# EAGLE schematic Enclosure_Control (EAGLE 9.5.0)
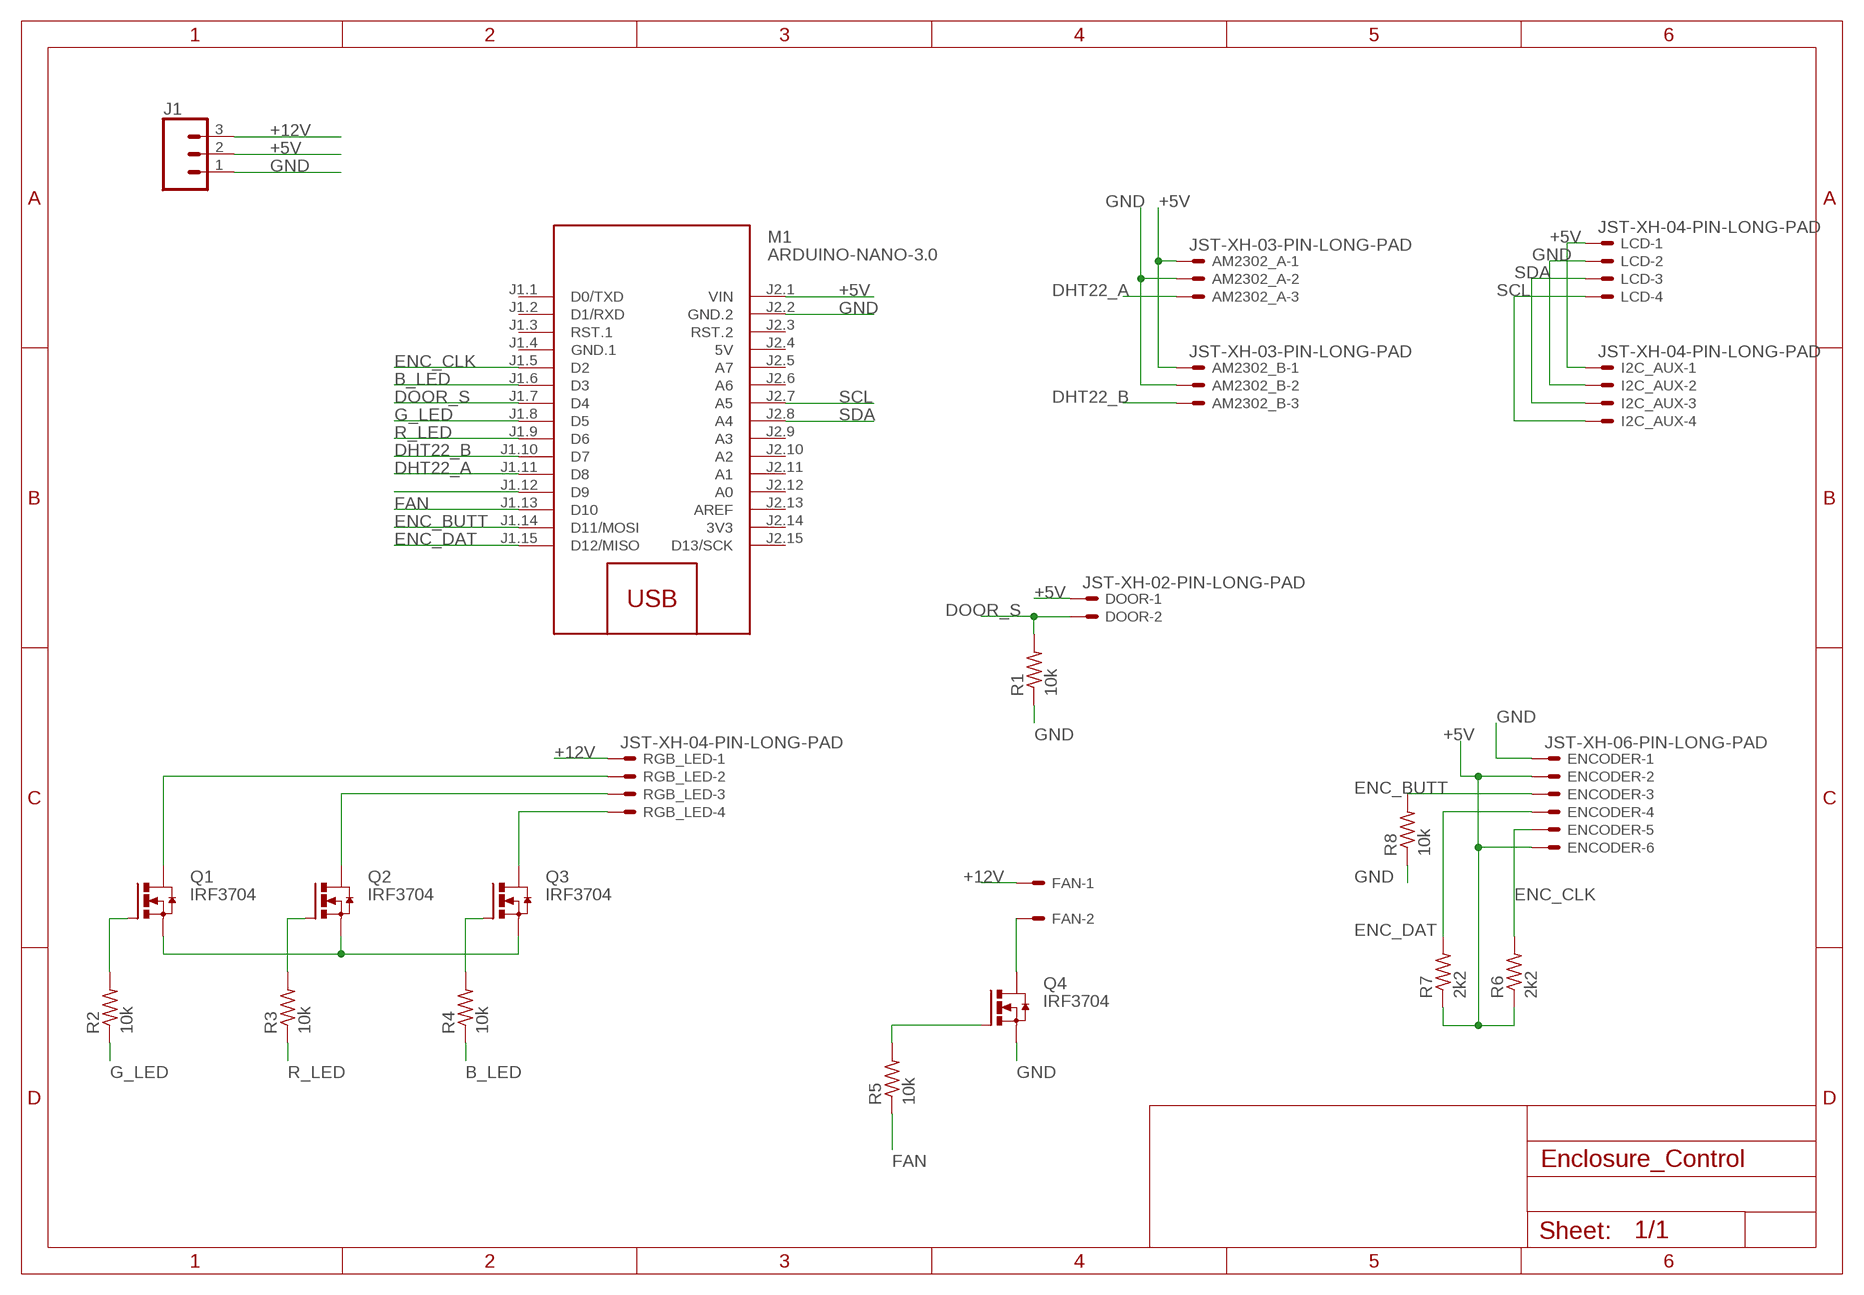
[diagram p0: schematic, sheet 1]

## Parts
AM2302_A  JST-XH-03-PIN-LONG-PAD  [JST-XH-03-PACKAGE-LONG-PAD]
AM2302_B  JST-XH-03-PIN-LONG-PAD  [JST-XH-03-PACKAGE-LONG-PAD]
DOOR  JST-XH-02-PIN-LONG-PAD  [JST-XH-02-PACKAGE-LONG-PAD]
ENCODER  JST-XH-06-PIN-LONG-PAD  [JST-XH-06-PACKAGE-LONG-PAD]
FAN  KK-156-2  [KK-156-2]
I2C_AUX  JST-XH-04-PIN-LONG-PAD  [JST-XH-04-PACKAGE-LONG-PAD]
J1  CONN_03SCREW-NS  [SCREWTERMINAL-3.5MM-3-NS]
LCD  JST-XH-04-PIN-LONG-PAD  [JST-XH-04-PACKAGE-LONG-PAD]
M1  ARDUINO-NANO-3.0  [ARDUINO-NANO-3.0]
Q1  IRF3704  [TO220AH]
Q2  IRF3704  [TO220AH]
Q3  IRF3704  [TO220AH]
Q4  IRF3704  [TO220AH]
R1  10k  R-US_0309/12  [0309/12]
R2  10k  R-US_0309/12  [0309/12]
R3  10k  R-US_0309/12  [0309/12]
R4  10k  R-US_0309/12  [0309/12]
R5  10k  R-US_0309/12  [0309/12]
R6  2k2  R-US_0309/12  [0309/12]
R7  2k2  R-US_0309/12  [0309/12]
R8  10k  R-US_0309/12  [0309/12]
RGB_LED  JST-XH-04-PIN-LONG-PAD  [JST-XH-04-PACKAGE-LONG-PAD]

## Nets
+5V: AM2302_A.1 AM2302_B.1 DOOR.1 ENCODER.2 ENCODER.6 I2C_AUX.1 J1.2 LCD.1 M1.J2.1(VIN) R6.1 R7.1
+12V: FAN.1 J1.3 RGB_LED.1
B_LED: M1.J1.6(D3) R4.1
DHT22_A: AM2302_A.3 M1.J1.11(D8)
DHT22_B: AM2302_B.3 M1.J1.10(D7)
DOOR_S: DOOR.2 M1.J1.7(D4) R1.2
ENC_BUTT: ENCODER.3 M1.J1.14(D11/MOSI) R8.2
ENC_CLK: ENCODER.5 M1.J1.5(D2) R6.2
ENC_DAT: ENCODER.4 M1.J1.15(D12/MISO) R7.2
FAN: M1.J1.13(D10) R5.1
G_LED: M1.J1.8(D5) R2.1
GND: AM2302_A.2 AM2302_B.2 ENCODER.1 I2C_AUX.2 J1.1 LCD.2 M1.J2.2(GND.2) Q4.E(S) R1.1 R8.1
N$1: Q1.E(S) Q2.E(S) Q3.E(S)
N$2: Q3.C(D) RGB_LED.4
N$3: Q2.C(D) RGB_LED.3
N$4: Q1.C(D) RGB_LED.2
N$5: Q1.B(G) R2.2
N$6: Q2.B(G) R3.2
N$7: Q3.B(G) R4.2
N$8: M1.J1.12(D9)
N$9: FAN.2 Q4.C(D)
N$12: Q4.B(G) R5.2
R_LED: M1.J1.9(D6) R3.1
SCL: I2C_AUX.4 LCD.4 M1.J2.7(A5)
SDA: I2C_AUX.3 LCD.3 M1.J2.8(A4)
Unconnected: M1.J1.1(D0/TXD) M1.J1.2(D1/RXD) M1.J1.3(RST.1) M1.J2.3(RST.2) M1.J2.5(A7) M1.J2.6(A6) M1.J2.9(A3) M1.J2.10(A2) M1.J2.11(A1) M1.J2.12(A0) M1.J2.13(AREF) M1.J2.15(D13/SCK)

## Power pins joined to a net without a drawn wire
3V3: M1.J2.14(3V3)
5V: M1.J2.4(5V)
GND.1: M1.J1.4(GND.1)

## Library data of the parts
AM2302_A AM2302_B = Rembrandt Electronics - JST XH Connectors v1-0:JST-XH-03-PIN: JST XH Connector 2 Pin Wire to board connector. Pitch: 2,54 mm, (0.100") Number of pins: 3 Created by Rembrandt Electronics www.rembrandtelectronics.com
DOOR = Rembrandt Electronics - JST XH Connectors v1-0:JST-XH-02-PIN: JST XH Connector 2 Pin Wire to board connector. Pitch: 2,54 mm, (0.100") Number of pins: 2 Created by Rembrandt Electronics www.rembrandtelectronics.com
ENCODER = Rembrandt Electronics - JST XH Connectors v1-0:JST-XH-06-PIN: JST XH Connector 2 Pin Wire to board connector. Pitch: 2,54 mm, (0.100") Number of pins: 6 Created by Rembrandt Electronics www.rembrandtelectronics.com
FAN = con-molex:KK-156-2: KK 156 HEADER Source: http://www.molex.com/pdm_docs/sd/026604100_sd.pdf; MF: MOLEX; OC_FARNELL: unknown; OC_NEWARK: unknown
I2C_AUX LCD RGB_LED = Rembrandt Electronics - JST XH Connectors v1-0:JST-XH-04-PIN: JST XH Connector 2 Pin Wire to board connector. Pitch: 2,54 mm, (0.100") Number of pins: 4 Created by Rembrandt Electronics www.rembrandtelectronics.com
J1 = SparkFun-Connectors:CONN_03: Multi connection point. Often used as Generic Header-pin footprint for 0.1 inch spaced/style header connections On any of the 0.1 inch spaced packages, you can populate with these: Break Away Headers - Straight <https://www.sparkfun.com/products/116> (PRT-00116) Break Away Male Headers - Right Angle <https://www.sparkfun.com/products/553> (PRT-00553) Female Headers <https://www.sparkfun.com/products/115> (PRT-00115) Break Away Headers - Machine Pin <https://www.sparkfun.com/products/117> (PRT-00117) Break Away Female Headers - Swiss Machine Pin <https://www.sparkfun.com/products/743> (PRT-00743) Stackable Header - 3 Pin (Female, 0.1") <https://www.sparkfun.com/products/13875> (PRT-13875) For SCREWTERMINALS and SPRING TERMINALS visit here: Screw Terimnals on SparkFun.com <https://www.sparkfun.com/search/results?term=Screw+Terminals> (5mm/3.5mm/2.54mm spacing) This device is also useful as a general connection point to wire up your design to another part of your project. Our various solder wires solder well into these plated through hole pads. Hook-Up Wire - Assortment (Stranded, 22 AWG) <https://www.sparkfun.com/products/11375> (PRT-11375) Hook-Up Wire - Assortment (Solid Core, 22 AWG) <https://www.sparkfun.com/products/11367> (PRT-11367) View the entire wire category on our website here <https://www.sparkfun.com/categories/141> Special notes: Molex polarized connector foot print use with SKU : PRT-08232 with associated crimp pins and housings.
M1 = diy-modules:ARDUINO-NANO-3.0: Arduino Nano 3.0
Q1-Q4 = transistor-power:IRF3704: SMPS MOSFET HEXFET® Power MOSFET Source: http://www.irf.com/product-info/datasheets/data/irf3704.pdf
R1-R8 = resistor:R-US_: RESISTOR, American symbol